# Altium project Kariboo GPS Antenna.PrjPcb
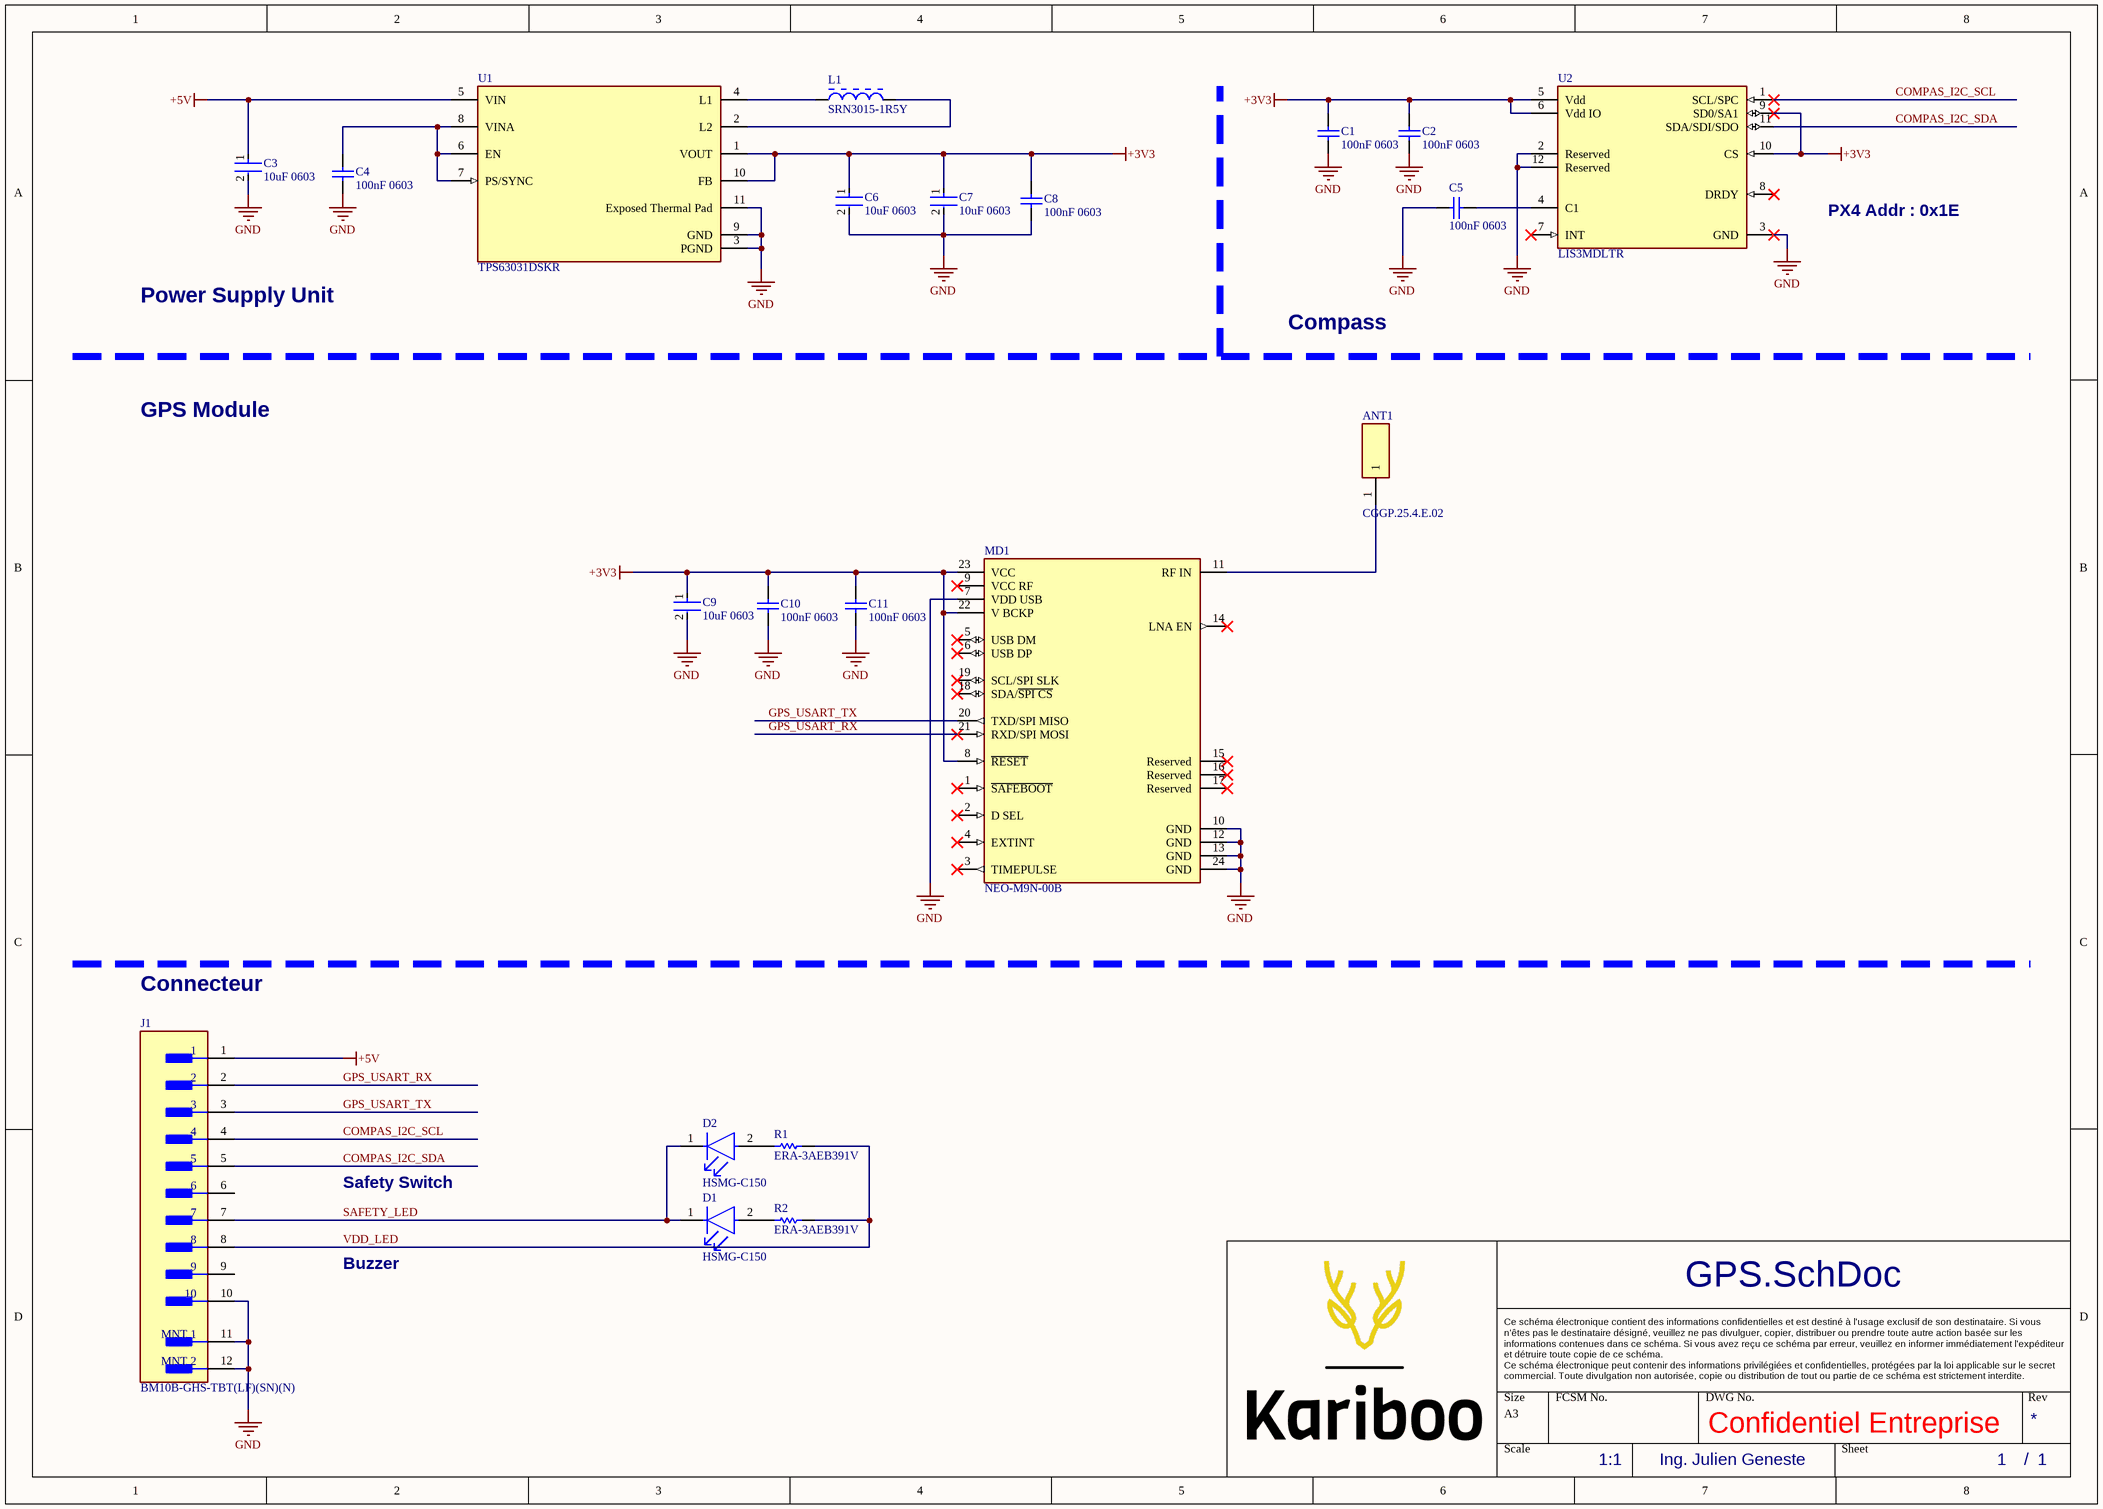
[diagram p0: GPS.SchDoc]
1 sheet, 21 parts. Net scope: global (net labels, ports and power ports of the same name join across sheets).
Board file: GPS.PcbDoc

## Sheet GPS.SchDoc
size A3; SheetNumber: 1; SheetTotal: 1

### Parts
ANT1  CGGP.25.4.E.02  [CGGP254E02]
C1  100nF 0603  [CAPC1608X90X35ML15T15]
C2  100nF 0603  [CAPC1608X90X35ML15T15]
C3  10uF 0603  [FP-GRM188-0_1-e0_2_0_55-IPC_A]
C4  100nF 0603  [CAPC1608X90X35ML15T15]
C5  100nF 0603  [CAPC1608X90X35ML15T15]
C6  10uF 0603  [FP-GRM188-0_1-e0_2_0_55-IPC_A]
C7  10uF 0603  [FP-GRM188-0_1-e0_2_0_55-IPC_A]
C8  100nF 0603  [CAPC1608X90X35ML15T15]
C9  10uF 0603  [FP-GRM188-0_1-e0_2_0_55-IPC_A]
C10  100nF 0603  [CAPC1608X90X35ML15T15]
C11  100nF 0603  [CAPC1608X90X35ML15T15]
D1  HSMG-C150  [FP-HSMG-C150-MFG]
D2  HSMG-C150  [FP-HSMG-C150-MFG]
J1  BM10B-GHS-TBT(LF)(SN)(N)  [FP-BM10B-GHS-TBT_LF_SN-MFG]
L1  SRN3015-1R5Y  [BOUR-SRN3015-2_V]
MD1  NEO-M9N-00B  [FP-NEO-M9N-00B-MFG]
R1  ERA-3AEB391V  [RESC1608X55X30ML20T20]
R2  ERA-3AEB391V  [RESC1608X55X30ML20T20]
U1  TPS63031DSKR  [FP-DSK0010A-MFG]
U2  LIS3MDLTR  [FP-VFLGA-12-8365767-MFG]

### Nets
+3V3: C1.1 C2.1 C6.1 C7.1 C8.2 C9.1 C10.2 C11.2 MD1.8(~{RESET}) MD1.22(V_BCKP) MD1.23(VCC) U1.1(VOUT) U1.10(FB) U2.5(Vdd) U2.6(Vdd_IO) U2.9(SD0/SA1) U2.10(CS)
+5V: C3.1 J1.1 U1.5(VIN)
GND: C1.2 C2.2 C3.2 C4.1 C5.2 C6.2 C7.2 C8.1 C9.2 C10.1 C11.1 J1.10 J1.11(MNT_1) J1.12(MNT_2) MD1.7(VDD_USB) MD1.10(GND) MD1.12(GND) MD1.13(GND) MD1.24(GND) U1.3(PGND) U1.9(GND) U1.11(Exposed_Thermal_Pad) U2.2(Reserved) U2.3(GND) U2.12(Reserved)
COMPAS_I2C_SCL: J1.4 U2.1(SCL/SPC)
COMPAS_I2C_SDA: J1.5 U2.11(SDA/SDI/SDO)
GPS_USART_RX: J1.2 MD1.21(RXD/SPI_MOSI)
GPS_USART_TX: J1.3 MD1.20(TXD/SPI_MISO)
SAFETY_LED: D1.1(C) D2.1(C) J1.7
VDD_LED: J1.8 R1.2 R2.2
NetANT1_1: ANT1.1 MD1.11(RF_IN)
NetC4_2: C4.2 U1.6(EN) U1.7(PS/SYNC) U1.8(VINA)
NetC5_1: C5.1 U2.4(C1)
NetD1_2: D1.2(A) R2.1
NetD2_2: D2.2(A) R1.1
NetL1_1: L1.1 U1.4(L1)
NetL1_2: L1.2 U1.2(L2)

Not connected (* = marked no-connect by the designer): J1 6 9; MD1 1(~{SAFEBOOT})* 2(D_SEL)* 3(TIMEPULSE)* 4(EXTINT)* 5(USB_DM)* 6(USB_DP)* 9(VCC_RF)* 14(LNA_EN)* 15(Reserved)* 16(Reserved)* 17(Reserved)* 18(SDA/~{SPI_CS})* 19(SCL/SPI_SLK)*; U2 7(INT)* 8(DRDY)*

### Notes on the sheet
- PX4 Addr : 0x1E
- Power Supply Unit
- Compass
- GPS Module
- Connecteur
- Safety Switch
- Buzzer
- Ce schéma électronique contient des informations confidentielles et est destiné à l'usage exclusif de son destinataire. Si vous n'êtes pas le destinataire désigné, veuillez ne pas divulguer, copier, distribuer ou prendre toute autre action basée sur les informations contenues dans ce schéma. Si vous avez reçu ce schéma par erreur, veuillez en informer immédiatement l'expéditeur et détruire toute copie de ce schéma.
  Ce schéma électronique peut contenir des informations privilégiées et confidentielles, protégées par la loi applicable sur le secret commercial. Toute divulgation non autorisée, copie ou distribution de tout ou partie de ce schéma est strictement interdite.
- Confidentiel Entreprise
- 1:1
- Ing. Julien Geneste
- /

### Library data of the parts
ANT1 = CGGP.25.4.E.02: Antenna; Manufacturer_Name: Taoglas; Datasheet Link: https://www.taoglas.com/wp-content/uploads/2015/04/CGGP.25.4.E.02.pdf; Height: 5.3mm; Manufacturer_Part_Number: CGGP.25.4.E.02; Mouser Part Number: 960-CGGP.25.4.E.02; Mouser Price/Stock: https://www.mouser.co.uk/ProductDetail/Taoglas/CGGP.25.4.E.02?qs=GmNq1OH0n5S3R7U0xHuQag%3D%3D; Arrow Part Number: CGGP.25.4.E.02; Arrow Price/Stock: https://www.arrow.com/en/products/cggp.25.4.e.02/taoglas?region=nac
C1 C2 C4 C5 C8 C10 C11 = CMP-2006-04496-1: Manufacturer: AVX Interconnect / Elco; Part Number: 0603YC104KAZ2A
C3 C6 C7 C9 = CMP-2006-02792-2: Chip Multilayer Ceramic Capacitors for General Purpose, 0603, 10uF, X5R, 15%, 20%, 6.3V; Packaging: Tape and Reel; Voltage Rating (DC): 6.3V; Width: 0.031inch; Termination: SMD/SMT; Dielectric: X5R; Package Quantity: 4000; Voltage Rating: 6.3V; Capacitance: 10uF; Case/Package: 0603; Min Operating Temperature: -55°C; Voltage: 6.3V; Length: 1.6mm; Thickness: 0.035inch; Lead Free: Lead Free; Depth: 0.8mm; Case Code (Imperial): 0603; Max Operating Temperature: 85°C; Material: Ceramic; Height: 0.8mm; Tolerance: 20%; Mount: Surface Mount; REACH SVHC: No SVHC; Radiation Hardening: No; Case Code (Metric): 1608
D1 D2 = CMP-2000-05061-2: LED GREEN DIFFUSED 1206 SMD; Manufacturer: Broadcom; Led Orientation: Top View; Max Junction Temp: +95°C; Peak Emmision Wavelength: 570nm; Viewing Angle: 170°; Wavelength: 572nm; Reverse Voltage: 5V; Luminous Intensity: 15mcd; Forward Voltage: 2.2V; Power Dissipation: 65mW; Forward Current: 20mA; ComponentLink2Description: Datasheet; Lead Free: Yes; Temperature Range Low: -40°C; Package: HSMG-C150; Digikey Description: LED GREEN DIFFUSED 1206 SMD; Mouser Description: LED Uni-Color Green 570nm 2-Pin Chip LED T/R; Manufacturer Part Number: HSMG-C150; Temperature Range High: +85°C; Device Class L1: Optoelectronics; Colour: Green; Category: Diode; Device Class L3: unset; RoHS: TRUE; Height: 1.2mm; ComponentLink2URL: https://docs.broadcom.com/docs/AV02-0551EN; Device Class L2: LEDs; Automotive: No; Ipc Land Pattern Name: DIOCP320160X55; Octopart: https://octopart.com/hsmg-c150-broadcom-71131304; Temperature: -40°C to +85°C
J1 = CMP-17439-000269-1: CONN HEADER SMD 10POS 1.25MM; Mated Stacking Heights: 7.3mm; Number of Positions: 10; Voltage Rating: 50V; Packaging: Cut Tape; Contact Shape: Rectangular; Insulation Material: Nylon; Contact Type: Outer Shroud Contact; Contact Finish - Mating: TIN; Fastening Type: Ramp; Termination: Solder; Max Operating Temperature: 85°C; Min Operating Temperature: -25°C; Insulation Color: Natural; Number of Rows: 1; Flammability Rating: UL94 V-0; Contact Material: Bronze; Mount: Surface Mount; Series: GH; Connector Type: Header
L1 = CMP-0007-00008-1: Semi-shielded Power Inductor, 1.5 uH, +/- 30%, 2.1 A, -40 to 125 degC, 3 x 3 x 1.5 mm SMD, RoHS and Halogen Free, Tape and Reel; Manufacturer: Bourns; SRF Min: 130 MHz; Rated current: 2.1 A; DCR Max: 0.066 Ohm; Inductance: 1.5 uH; Isat: 2 A; Inductance tolerance: +/- 30%; Resistance to Solder Heat: +260 degC for 10 sec.; RoHS: TRUE; Mounting Technology: Surface Mount; ComponentLink1Description: Manufacturer URL; ComponentLink1URL: http://www.bourns.com/; PartNumber: SRN3015-1R5Y; ComponentLink3Description: Package Specification; ComponentLink3URL: http://www.bourns.com/data/global/pdfs/SRN3015.pdf; Operating Temperature: -40 to 125 degC; PackageReference: SRN3015; DatasheetVersion: Aug-11; Packing: Tape and Reel; ComponentLink2Description: Datasheet; PackageDescription: 2-Pin SMD, Body 3 x 3 mm, Height 1.5 mm; ComponentLink2URL: http://www.bourns.com/data/global/pdfs/SRN3015.pdf
MD1 = CMP-207130-000006-2: M9 standard precision module; Manufacturer: u-blox; Min Supply Voltage: 1.65V; Sensitivity: -167dBm; Interface: I2C,SPI,UART,USB; Max Supply Voltage: 3.6V; Device Class L3: RF Receivers; Category: UNK; Temperature Range Low: -40°C; Temperature Range High: +85°C; ComponentLink2Description: Datasheet; Manufacturer Part Number: NEO-M9N-00B; ComponentLink2URL: https://www.u-blox.com/sites/default/files/NEO-M9N_DataSheet_%28UBX-19014285%29.pdf; Footprint Url: https://www.u-blox.com/sites/default/files/NEO-M9N_Integrationmanual_%28UBX-19014286%29.pdf; Height: 2.6mm; Automotive: No; RoHS: TRUE; Lead Free: Yes; Octopart: https://octopart.com/neo-m9n-00b-u-blox-107315722; Package: 0; Temperature: -40°C to +85°C; Device Class L1: Integrated Circuits (ICs); Device Class L2: RF Semiconductors and Devices
R1 R2 = CMP-2000-00051-1: Manufacturer: Panasonic; Part Number: ERA-3AEB391V
U1 = CMP-04918-000123-1: IC REG BCK BST ADJ 900MA 10SON; Manufacturer: Texas Instruments; Switching Frequency: 2400kHz; Number Of Outputs: 1; Output Voltage: 1.2-5.5V; Max Supply Voltage: 5.5V; Nominal Supply Current: 25uA; Min Supply Voltage: 1.8V; Max Duty Cycle: 100%; Standoff Height: 0mm; Max Junction Temp: +125°C; Switching Topology: Buck-Boost; Output Type: AdjustableProgrammable; Output Current: 1A; Temperature Range High: +85°C; Device Class L2: Power Management ICs; ComponentLink2URL: http://www.ti.com/lit/ds/symlink/tps63030.pdf; Category: IC; Ambient Temperature Range Low: -40°C; Device Class L3: Voltage Regulators - Switching; Ipc Land Pattern Name: DFN250X250X75-10; Mouser Description: Voltage Regulators - Switching Regulators Hi Eff Sgl Inductor Buck-Boost Conv; Automotive: No; ComponentLink2Description: Datasheet; Digikey Description: IC REG BCK BST ADJ 900MA 10SON; RoHS: TRUE; Octopart: https://octopart.com/tps63030dskr-texas+instruments-12188297; Height: 0.8mm; Ambient Temperature Range High: +85°C; Package: DSK0010A; Lead Free: Yes; Temperature Range Low: -40°C; Device Class L1: Integrated Circuits (ICs); Temperature: -40°C to +85°C; Manufacturer Part Number: TPS63031DSKR
U2 = CMP-2000-07463-2: SENSOR MR I2C/SPI 12LGA; Manufacturer: STMicroelectronics; Sensor Output: I2C,SPI; Operating Supply Current: 40-270uA; Max Supply Voltage: 3.6V; Sensing Method: Magnetic; Min Supply Voltage: 1.71V; ComponentLink2URL: https://www.st.com/resource/en/datasheet/lis3mdl.pdf; Category: IC; Manufacturer Part Number: LIS3MDLTR; Octopart: https://octopart.com/lis3mdltr-stmicroelectronics-29403125; Automotive: No; ComponentLink2Description: Datasheet; RoHS: TRUE; Device Class L3: unset; Device Class L1: Sensors; Temperature: -40°C to +85°C; Height: 1mm; Mouser Description: Board Mount Hall Effect / Magnetic Sensors Ultra Lo-Pwr Hi Perf 3-Axis 1.9-3.6V; Temperature Range High: +85°C; Lead Free: Yes; Device Class L2: Magnetic Sensors; Footprint Url: https://www.st.com/content/ccc/resource/technical/document/technical_note/73/17/9c/16/dd/96/4a/01/CD00134799.pdf/files/CD00134799.pdf/jcr:content/translations/en.CD00134799.pdf; Temperature Range Low: -40°C; Package: VFLGA-12-8365767; Digikey Description: SENSOR MR I2C/SPI 12LGA